# Altium schematic sheet Transmitter_old.SchDoc
size A4; Organization: Altium Limited; Address1: L3, 12a Rodborough Rd; Address2: Frenchs Forest; Address3: NSW; Address4: Australia 2086
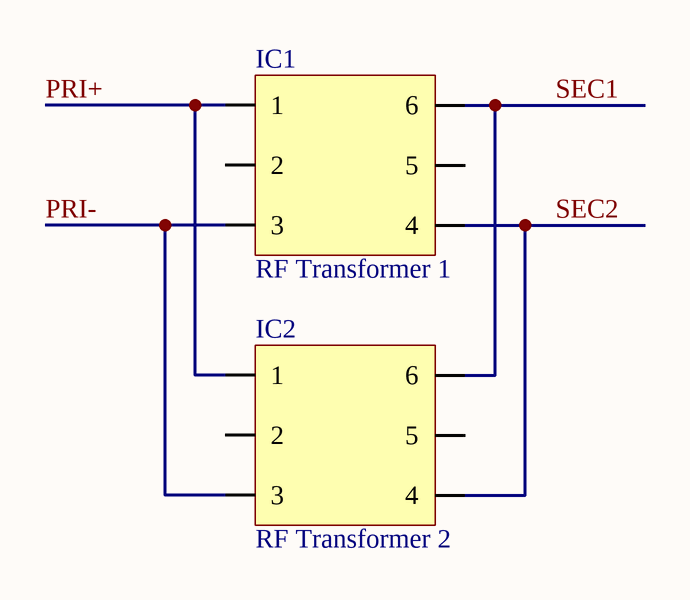
[diagram p0: Transmitter_old.SchDoc]

## Parts
IC1  RF Transformer 1  [PWB-X-XL_]
IC2  RF Transformer 2  [PWB-X-XL_]

## Nets
PRI+: IC1.1 IC2.1
PRI-: IC1.3 IC2.3
SEC1: IC1.6 IC2.6
SEC2: IC1.4 IC2.4

Not connected (* = marked no-connect by the designer): IC1 2 5; IC2 2 5

## Notes on the sheet
- Title
- Size:
- Date:
- A4
- Number:
- Time:
- Revision:
- Sheet
- of
- File:

## Library data of the parts
IC1 IC2 = RF Transformer